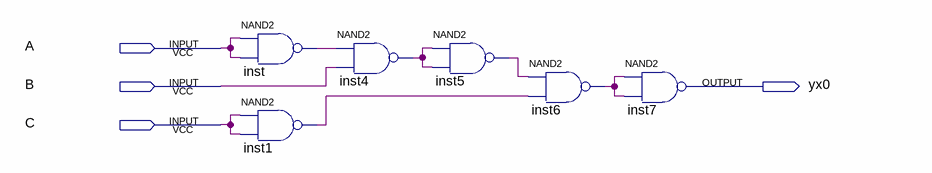
[diagram p0: schematic sheet]
// Quartus schematic DZ1_Quartus_decoder_yx1.bdf as structural Verilog: 6 symbols, 4 pins
module DZ1_Quartus_decoder_yx1 (
  input  A,
  input  B,
  input  C,
  output yx0
);

  wire inst1_out, inst4_out, inst5_out, inst6_out, inst_out;

  nand inst (inst_out, A, A);
  nand inst1 (inst1_out, C, C);
  nand inst4 (inst4_out, inst_out, B);
  nand inst5 (inst5_out, inst4_out, inst4_out);
  nand inst6 (inst6_out, inst5_out, inst1_out);
  nand inst7 (yx0, inst6_out, inst6_out);
endmodule
